# Altium schematic sheet 05-LVDS_RGB.SchDoc
size A4; 学校: 辽宁工程技术大学; 考号: 2107010403; 证件号: 532124200305070711; 图号: 第1幅; 图号数: 总共7幅; SheetNumber: 5; SheetTotal: 7; 单位名称: 辽宁工程技术大学; 身份证号: 532124200305070711; 姓名: 邓祥涛; 图名: mydesign; 选手编号: 84011514
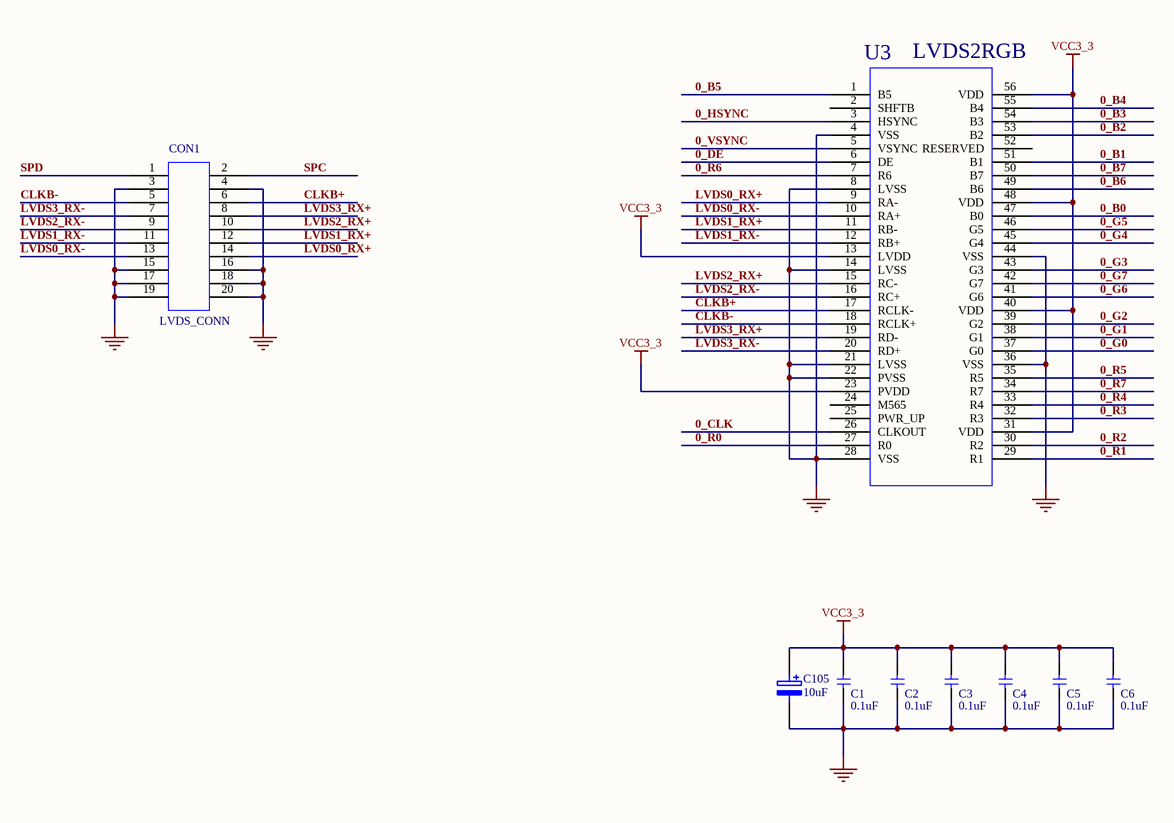
[diagram p0: 05-LVDS_RGB.SchDoc]

## Parts
C1  value 0.1uF  [C0603]  (hidden comment: C_2)
C2  value 0.1uF  [C0603]  (hidden comment: C_2)
C3  value 0.1uF  [C0603]  (hidden comment: C_2)
C4  value 0.1uF  [C0603]  (hidden comment: C_2)
C5  value 0.1uF  [C0603]  (hidden comment: C_2)
C6  value 0.1uF  [C0603]  (hidden comment: C_2)
C105  10uF  [3528-C]
CON1  value LVDS_CONN  [JTAG-20X2.54]  (hidden comment: CON20A)
U3  value LVDS2RGB  [TSSOP56]  (hidden comment: EP102)

## Nets
GND: C1.1 C2.1 C3.1 C4.1 C5.1 C6.1 C105.2 CON1.3 CON1.4 CON1.15 CON1.16 CON1.17 CON1.18 CON1.19 CON1.20 U3.4(VSS) U3.8(LVSS) U3.14(LVSS) U3.21(LVSS) U3.22(PVSS) U3.28(VSS) U3.36(VSS) U3.44(VSS)
VCC3_3: C1.2 C2.2 C3.2 C4.2 C5.2 C6.2 C105.1 U3.13(LVDD) U3.23(PVDD) U3.31(VDD) U3.40(VDD) U3.48(VDD) U3.56(VDD)
0_B0: U3.47(B0)
0_B1: U3.51(B1)
0_B2: U3.53(B2)
0_B3: U3.54(B3)
0_B4: U3.55(B4)
0_B5: U3.1(B5)
0_B6: U3.49(B6)
0_B7: U3.50(B7)
0_CLK: U3.26(CLKOUT)
0_DE: U3.6(DE)
0_G0: U3.37(G0)
0_G1: U3.38(G1)
0_G2: U3.39(G2)
0_G3: U3.43(G3)
0_G4: U3.45(G4)
0_G5: U3.46(G5)
0_G6: U3.41(G6)
0_G7: U3.42(G7)
0_HSYNC: U3.3(HSYNC)
0_R0: U3.27(R0)
0_R1: U3.29(R1)
0_R2: U3.30(R2)
0_R3: U3.32(R3)
0_R4: U3.33(R4)
0_R5: U3.35(R5)
0_R6: U3.7(R6)
0_R7: U3.34(R7)
0_VSYNC: U3.5(VSYNC)
CLKB+: CON1.6 U3.17(RCLK-)
CLKB-: CON1.5 U3.18(RCLK+)
LVDS0_RX+: CON1.14 U3.9(RA-)
LVDS0_RX-: CON1.13 U3.10(RA+)
LVDS1_RX+: CON1.12 U3.11(RB-)
LVDS1_RX-: CON1.11 U3.12(RB+)
LVDS2_RX+: CON1.10 U3.15(RC-)
LVDS2_RX-: CON1.9 U3.16(RC+)
LVDS3_RX+: CON1.8 U3.19(RD-)
LVDS3_RX-: CON1.7 U3.20(RD+)
SPC: CON1.2
SPD: CON1.1

Not connected (* = marked no-connect by the designer): U3 2(SHFTB) 24(M565) 25(PWR_UP) 52(RESERVED)

## Notes on the sheet
- 单位名称
- 选手信息
- 图名
- 文件名
- 当前日期
- 第
- 幅
- 当前时间
- 总共

## Library data of the parts
C1-C6 = C_2: PCB DECAL: 0603; SOURCE_PATH: C:\ORCAD\ORCAD_10.0\TOOLS\CAPTURE\LIBRARY\PSPICE\ANALOG.OLB; DIST: FLAT; PSPICETEMPLATE: C^@REFDES %1 %2 ?TOLERANCE|C^@REFDES| @VALUE ?IC/IC=@IC/ ?TOLERANCE|\n.model C^@REFDES CAP C=1 DEV=@TOLERANCE%|; VOLTAGE: CMAX; CURRENT: CIMAX; KNEE: CBMAX; SLOPE: CSMAX; MAX_TEMP: CTMAX
C105 = ELECTRO2: Electrolytic Capacitor
CON1 = CON20A: SOURCE_PATH: C:\ORCAD\ORCAD_10.0\TOOLS\CAPTURE\LIBRARY\CONNECTOR.OLB; PCB DECAL: JTAG-20X2.54
U3 = EP102: SOURCE_PATH: D:\CHRONTEL\CT365\MB LVDS DAUGHER CARD\LIBRARY LVDS.OLB; PCB DECAL: TSSOP56